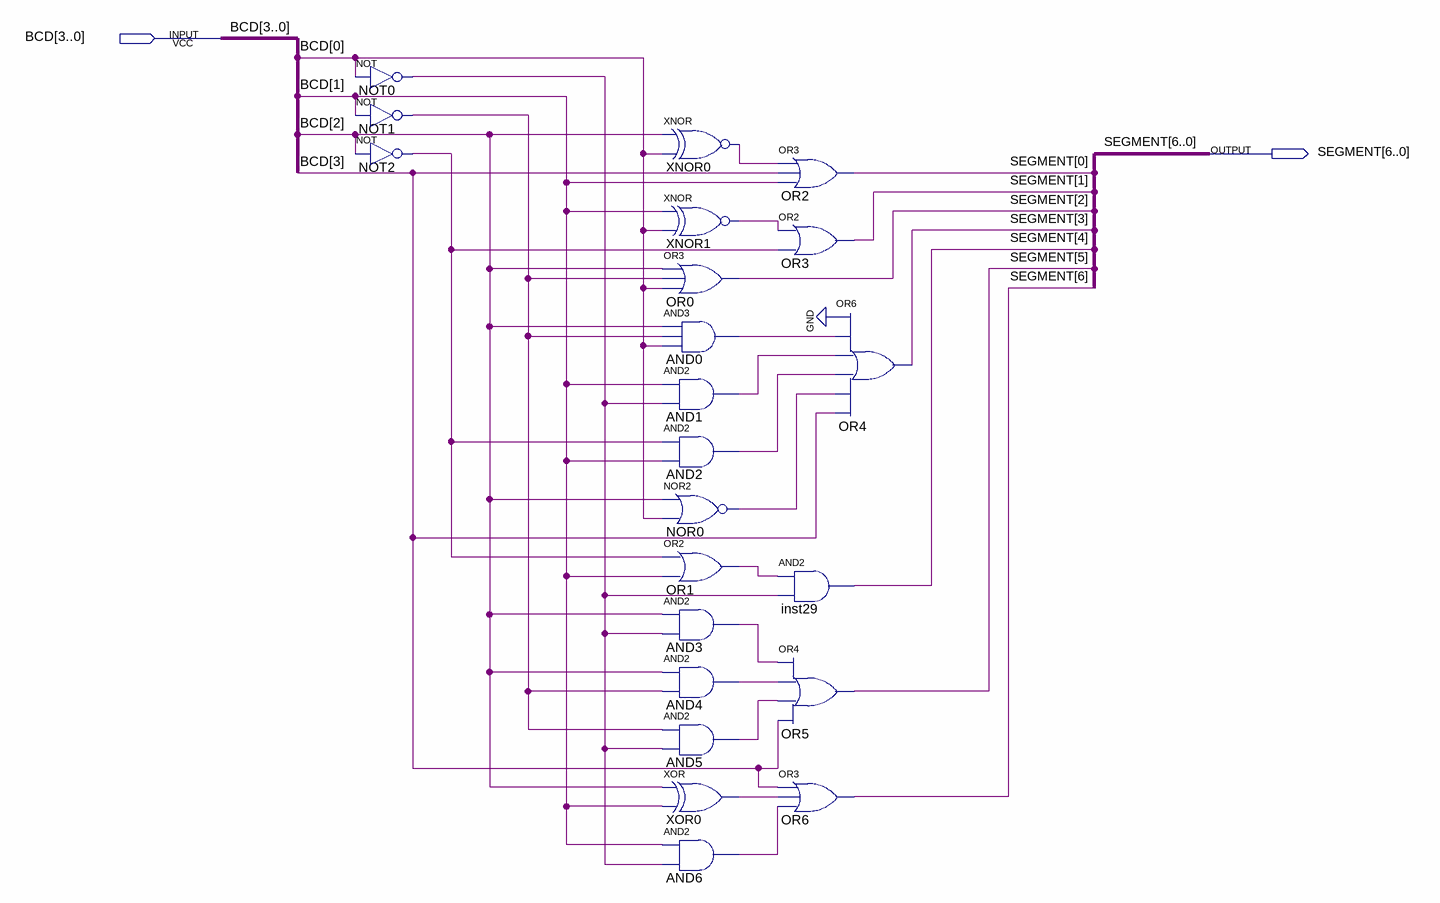
[diagram p0: schematic sheet]
// Quartus schematic BCD_7_SEG.bdf as structural Verilog: 22 symbols, 2 pins
module BCD_7_SEG (
  input  [3:0] BCD,
  output [6:0] SEGMENT
);

  wire AND0_out, AND1_out, AND2_out, AND3_out, AND4_out, AND5_out, AND6_out, NOR0_out, NOT0_out, NOT1_out,
       NOT2_out, OR1_out, XNOR0_out, XNOR1_out, XOR0_out;

  not NOT0 (NOT0_out, BCD[0]);
  not NOT1 (NOT1_out, BCD[1]);
  not NOT2 (NOT2_out, BCD[2]);
  xnor XNOR0 (XNOR0_out, BCD[2], BCD[0]);
  xnor XNOR1 (XNOR1_out, BCD[1], BCD[0]);
  or OR0 (SEGMENT[2], BCD[2], NOT1_out, BCD[0]);
  and AND0 (AND0_out, BCD[2], NOT1_out, BCD[0]);
  and AND1 (AND1_out, BCD[1], NOT0_out);
  and AND2 (AND2_out, NOT2_out, BCD[1]);
  nor NOR0 (NOR0_out, BCD[2], BCD[0]);
  or OR1 (OR1_out, NOT2_out, BCD[1]);
  and AND3 (AND3_out, BCD[2], NOT0_out);
  and AND4 (AND4_out, BCD[2], NOT1_out);
  and AND5 (AND5_out, NOT1_out, NOT0_out);
  xor XOR0 (XOR0_out, BCD[2], BCD[1]);
  and AND6 (AND6_out, BCD[1], NOT0_out);
  or OR2 (SEGMENT[0], XNOR0_out, BCD[3], BCD[1]);
  or OR3 (SEGMENT[1], XNOR1_out, NOT2_out);
  or OR4 (SEGMENT[3], 1'b0, AND0_out, AND1_out, AND2_out, NOR0_out, BCD[3]);
  and inst29 (SEGMENT[4], OR1_out, NOT0_out);
  or OR5 (SEGMENT[5], AND3_out, AND4_out, AND5_out, BCD[3]);
  or OR6 (SEGMENT[6], BCD[3], XOR0_out, AND6_out);
endmodule
